# EAGLE schematic PIC_PERIPHERALS (EAGLE 6.1)

## Sheet 1 of 6: The LED Drivers for the ROV. - 2x forward facing - 2x backwards facing
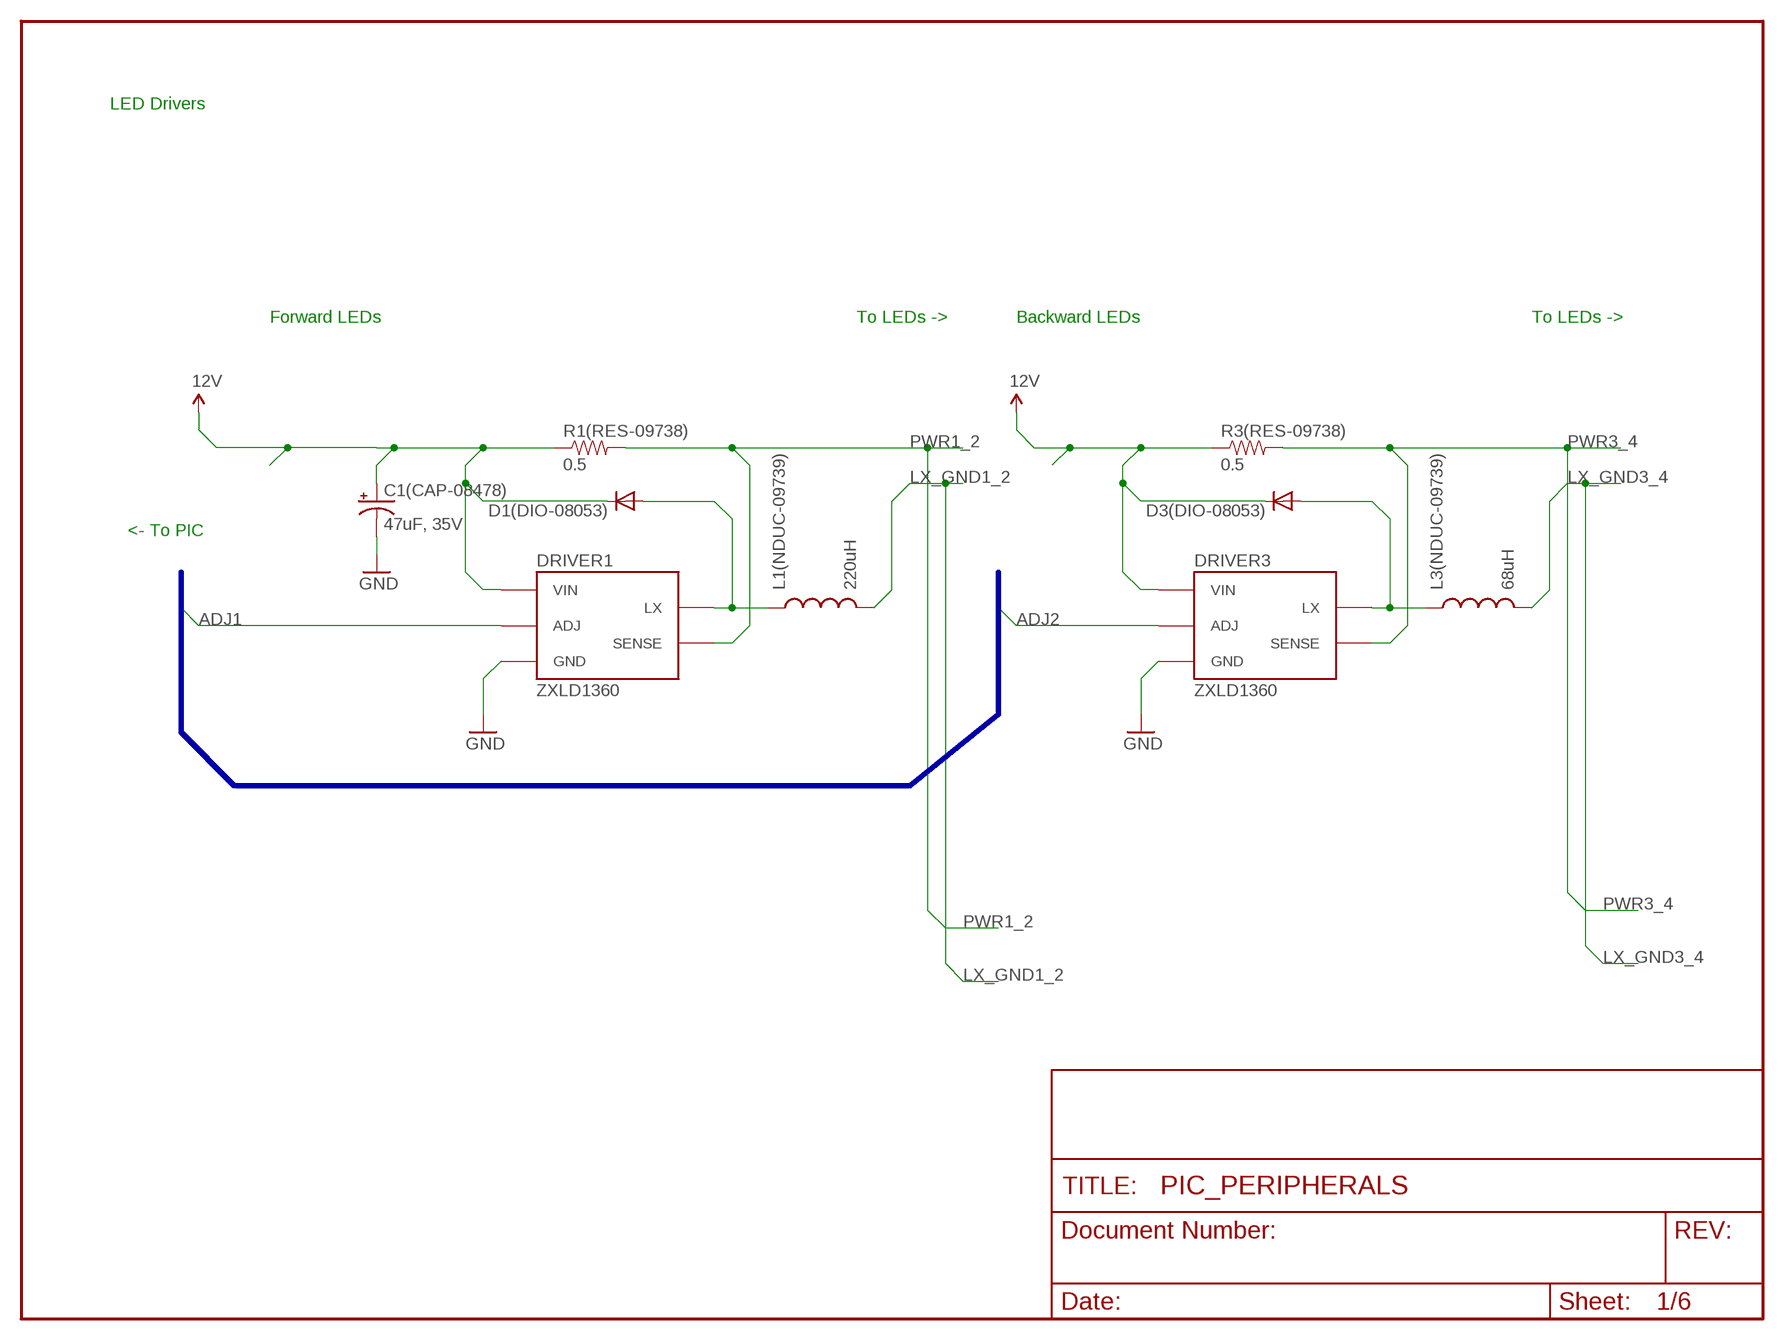
[diagram p0: schematic, sheet 1]

### Parts
C1(CAP-08478)  47uF, 35V  CAP_POL1206  [EIA3216]
D1(DIO-08053)  DIODESMA  [SMA-DIODE]
D3(DIO-08053)  DIODESMA  [SMA-DIODE]
DRIVER1  ZXLD1360  [SOT23-5]
DRIVER3  ZXLD1360  [SOT23-5]
L1(NDUC-09739)  220uH  INDUCTOR-  [CDRH3D28]
L3(NDUC-09739)  68uH  INDUCTOR-  [CDRH3D28]
R1(RES-09738)  0.5  RESISTOR0805-RES  [0805]
R3(RES-09738)  0.5  RESISTOR0805-RES  [0805]

### Nets
5V: D3(DIO-08053).C DRIVER3.5(VIN) R3(RES-09738).1 ; supply symbol labelled 12V ; also sheet 2,3,4,5,6
12V: C1(CAP-08478).A(+) D1(DIO-08053).C DRIVER1.5(VIN) R1(RES-09738).1
ADJ1: DRIVER1.3(ADJ) ; also sheet 5
ADJ2: DRIVER3.3(ADJ) ; also sheet 5
GND: C1(CAP-08478).C(-) DRIVER1.2(GND) DRIVER3.2(GND) ; also sheet 2,3,4,5,6
LX_GND1_2: L1(NDUC-09739).2
LX_GND3_4: L3(NDUC-09739).2
N$9: D1(DIO-08053).A DRIVER1.1(LX) L1(NDUC-09739).1
N$10: D3(DIO-08053).A DRIVER3.1(LX) L3(NDUC-09739).1
PWR1_2: DRIVER1.4(SENSE) R1(RES-09738).2
PWR3_4: DRIVER3.4(SENSE) R3(RES-09738).2

### Buses
B$1

### Notes on the sheet
- LED Drivers
- Forward LEDs | To LEDs -> | Backward LEDs | To LEDs ->
- <- To PIC

## Sheet 2 of 6: Ther Servo Drivers for the ROV. - Rudder Servo - Webcam Servo #1 - Webcam Servo #2
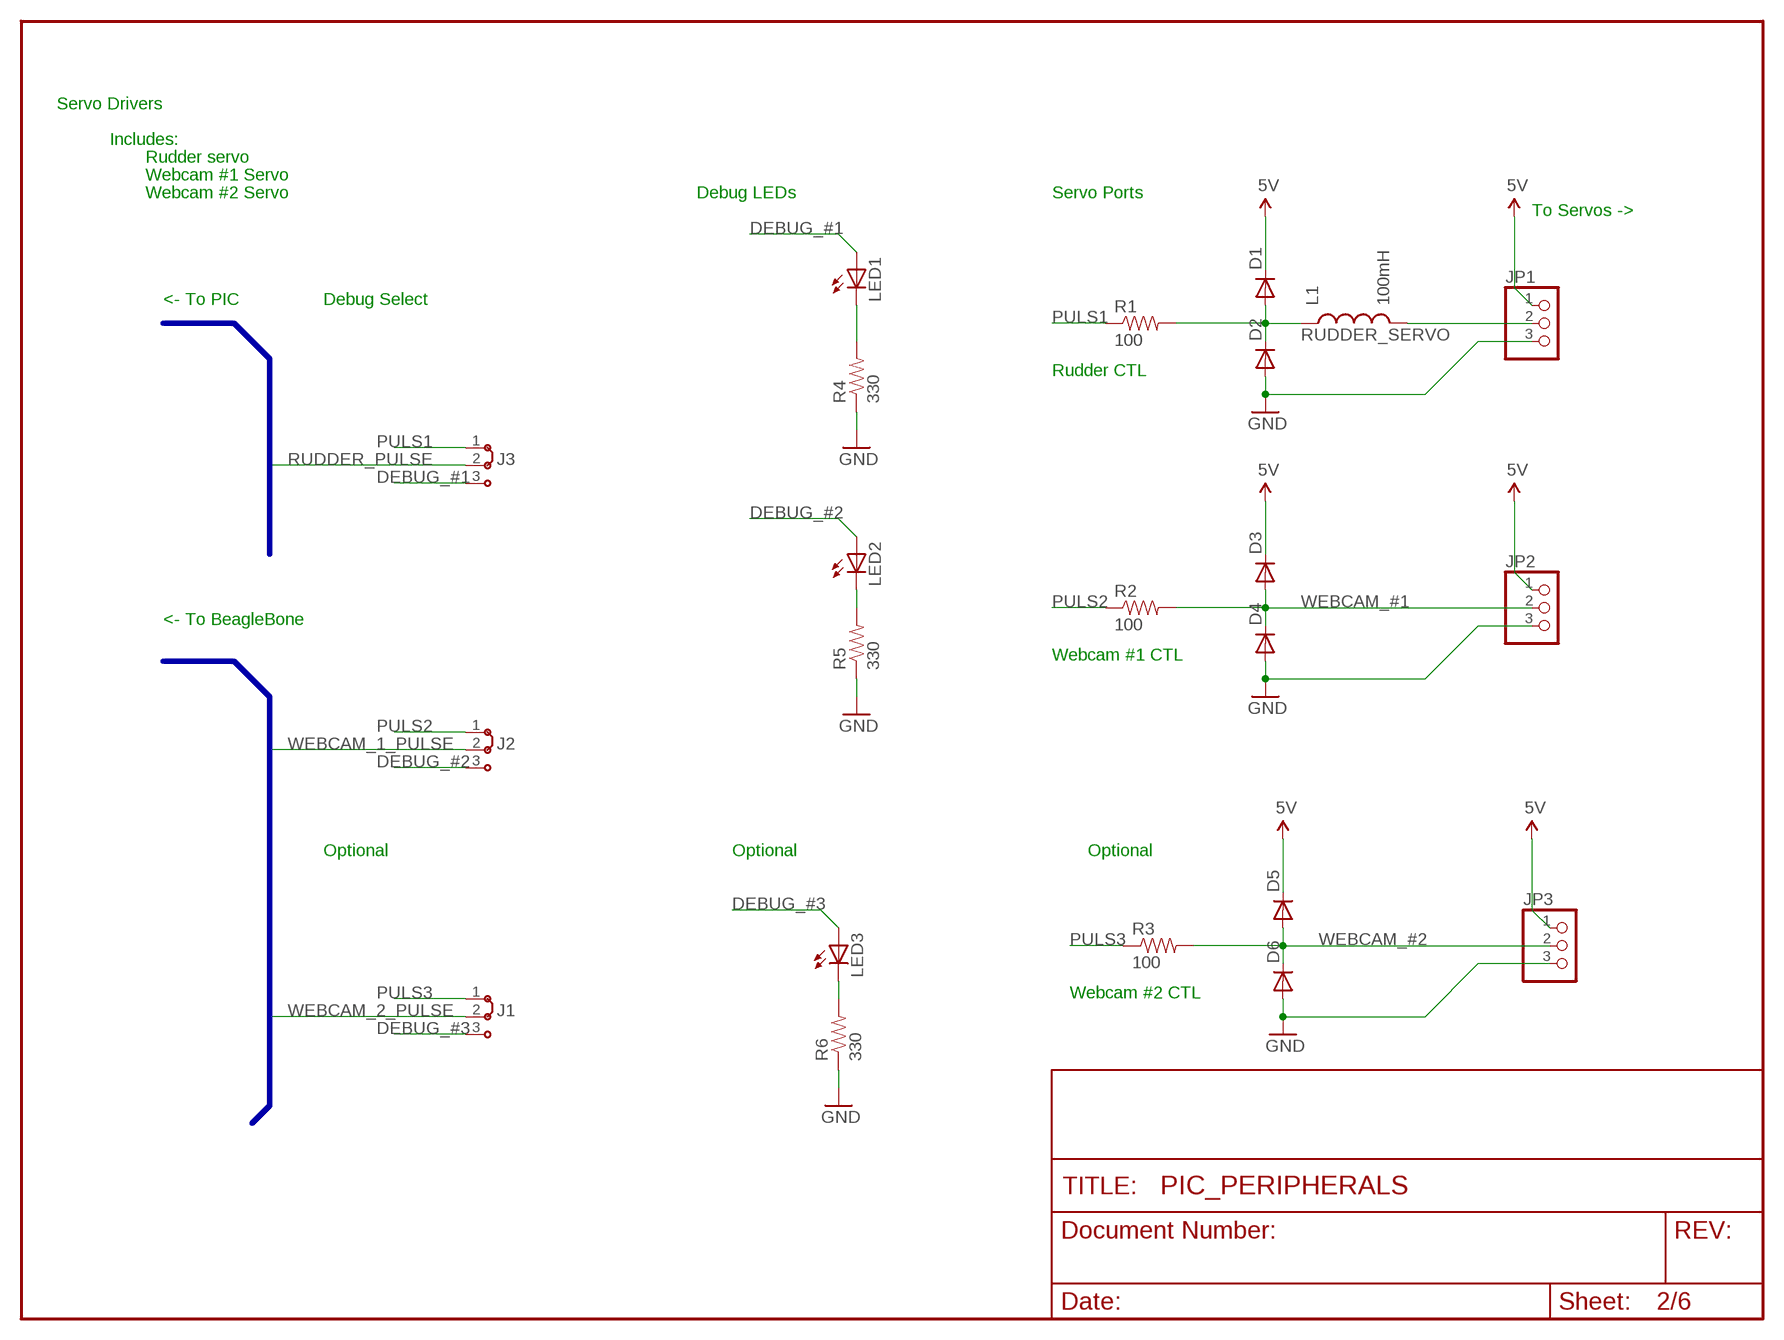
[diagram p1: schematic, sheet 2]

### Parts
D1  DIODESMA-ALT  [SMA-DIODE_ALT]
D2  DIODESMA-ALT  [SMA-DIODE_ALT]
D3  DIODESMA-ALT  [SMA-DIODE_ALT]
D4  DIODESMA-ALT  [SMA-DIODE_ALT]
D5  DIODESMA-ALT  [SMA-DIODE_ALT]
D6  DIODESMA-ALT  [SMA-DIODE_ALT]
J1  J2X2MM  [04C]
J2  J2X2MM  [04C]
J3  J2X2MM  [04C]
JP1  PINHD-1X3CB  [1X03-CLEANBIG]
JP2  PINHD-1X3CB  [1X03-CLEANBIG]
JP3  PINHD-1X3CB  [1X03-CLEANBIG]
L1  100mH  INDUCTOR0805  [0805]
LED1  LED  [SMARTLED-TTW]
LED2  LED  [SMARTLED-TTW]
LED3  LED  [SMARTLED-TTW]
R1  100  RESISTOR0402-RES  [0402-RES]
R2  100  RESISTOR0402-RES  [0402-RES]
R3  100  RESISTOR0402-RES  [0402-RES]
R4  330  RESISTOR0402-RES  [0402-RES]
R5  330  RESISTOR0402-RES  [0402-RES]
R6  330  RESISTOR0402-RES  [0402-RES]

### Nets
5V: D1.C D3.C D5.C JP1.1 JP2.1 JP3.1 ; also sheet 1,3,4,5,6
DEBUG_#1: J3.3 LED1.A@1(A)
DEBUG_#2: J2.3 LED2.A@1(A)
DEBUG_#3: J1.3 LED3.A@1(A)
GND: D2.A D4.A D6.A JP1.3 JP2.3 JP3.3 R4.1 R5.1 R6.1 ; also sheet 1,3,4,5,6
N$1: LED1.C@1(C) R4.2
N$2: LED2.C@1(C) R5.2
N$3: LED3.C@1(C) R6.2
PULS1: J3.1 R1.1
PULS2: J2.1 R2.1
PULS3: J1.1 R3.1
RUDDER_PULSE: J3.2 ; also sheet 5
RUDDER_SERVO: JP1.2 L1.2
RUDDER_SERVO1: D1.A D2.C L1.1 R1.2
WEBCAM_1_PULSE: J2.2 ; also sheet 4
WEBCAM_2_PULSE: J1.2 ; also sheet 4
WEBCAM_#1: D3.A D4.C JP2.2 R2.2
WEBCAM_#2: D5.A D6.C JP3.2 R3.2

### Buses
B$2
B$4

### Notes on the sheet
- Servo Drivers
- Includes:
- Rudder servo
- Webcam #1 Servo
- Webcam #2 Servo | Debug LEDs | Servo Ports
- To Servos ->
- <- To PIC | Debug Select
- Rudder CTL
- <- To BeagleBone
- Webcam #1 CTL
- Optional | Optional | Optional
- Webcam #2 CTL

## Sheet 3 of 6: The ESD controller drivers for the Brushless motors. - Left Thruster - Right Thruster - Vertical Thruster
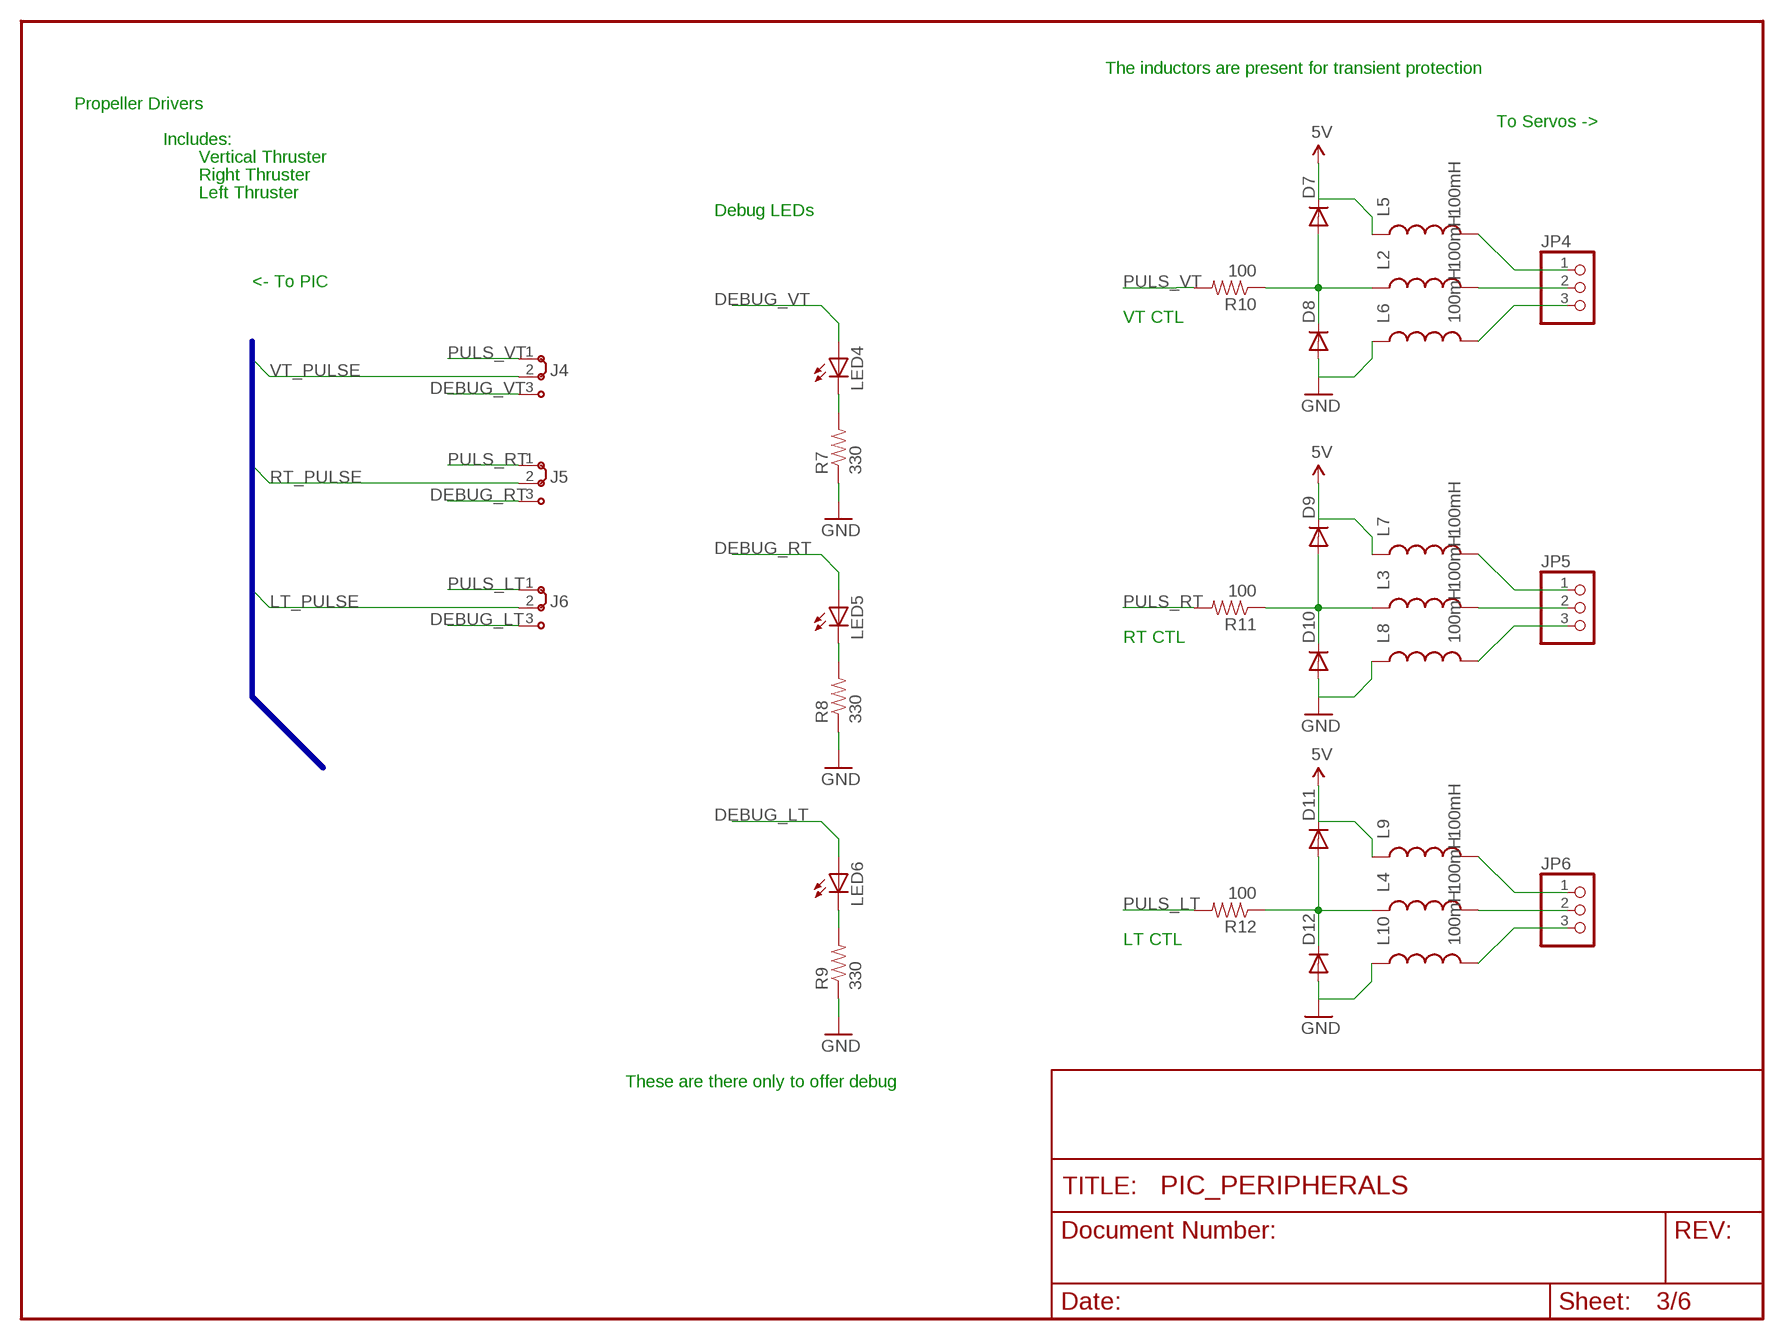
[diagram p2: schematic, sheet 3]

### Parts
D7  DIODESMA  [SMA-DIODE]
D8  DIODESMA  [SMA-DIODE]
D9  DIODESMA  [SMA-DIODE]
D10  DIODESMA  [SMA-DIODE]
D11  DIODESMA  [SMA-DIODE]
D12  DIODESMA  [SMA-DIODE]
J4  J2X2MM  [04C]
J5  J2X2MM  [04C]
J6  J2X2MM  [04C]
JP4  PINHD-1X3CB  [1X03-CLEANBIG]
JP5  PINHD-1X3CB  [1X03-CLEANBIG]
JP6  PINHD-1X3CB  [1X03-CLEANBIG]
L2  100mH  INDUCTOR0603  [0603]
L3  100mH  INDUCTOR0603  [0603]
L4  100mH  INDUCTOR0603  [0603]
L5  100mH  INDUCTOR0603  [0603]
L6  100mH  INDUCTOR0603  [0603]
L7  100mH  INDUCTOR0603  [0603]
L8  100mH  INDUCTOR0603  [0603]
L9  100mH  INDUCTOR0603  [0603]
L10  100mH  INDUCTOR0603  [0603]
LED4  LED  [SMARTLED-TTW]
LED5  LED  [SMARTLED-TTW]
LED6  LED  [SMARTLED-TTW]
R7  330  RESISTOR0402-RES  [0402-RES]
R8  330  RESISTOR0402-RES  [0402-RES]
R9  330  RESISTOR0402-RES  [0402-RES]
R10  100  RESISTOR0402-RES  [0402-RES]
R11  100  RESISTOR0402-RES  [0402-RES]
R12  100  RESISTOR0402-RES  [0402-RES]

### Nets
5V: D7.C D9.C D11.C L5.1 L7.1 L9.1 ; also sheet 1,2,4,5,6
DEBUG_LT: J6.3 LED6.A@1(A)
DEBUG_RT: J5.3 LED5.A@1(A)
DEBUG_VT: J4.3 LED4.A@1(A)
GND: D8.A D10.A D12.A L6.1 L8.1 L10.1 R7.1 R8.1 R9.1 ; also sheet 1,2,4,5,6
LT_PULSE: J6.2 ; also sheet 5
N$5: LED4.C@1(C) R7.2
N$7: LED5.C@1(C) R8.2
N$13: LED6.C@1(C) R9.2
N$15: D11.A D12.C L4.1 R12.1
N$17: D9.A D10.C L3.1 R11.1
N$18: D7.A D8.C L2.1 R10.1
N$20: JP4.1 L5.2
N$21: JP4.2 L2.2
N$22: JP4.3 L6.2
N$23: JP5.1 L7.2
N$24: JP5.2 L3.2
N$25: JP5.3 L8.2
N$26: JP6.1 L9.2
N$27: JP6.2 L4.2
N$28: JP6.3 L10.2
PULS_LT: J6.1 R12.2
PULS_RT: J5.1 R11.2
PULS_VT: J4.1 R10.2
RT_PULSE: J5.2 ; also sheet 5
VT_PULSE: J4.2 ; also sheet 5

### Buses
B$3

### Notes on the sheet
- The inductors are present for transient protection
- Propeller Drivers
- To Servos ->
- Includes:
- Vertical Thruster
- Right Thruster
- Left Thruster
- Debug LEDs
- <- To PIC
- VT CTL
- RT CTL
- LT CTL
- These are there only to offer debug

## Sheet 4 of 6: The IDEEPROM circuit and the Level Shifter circuit.
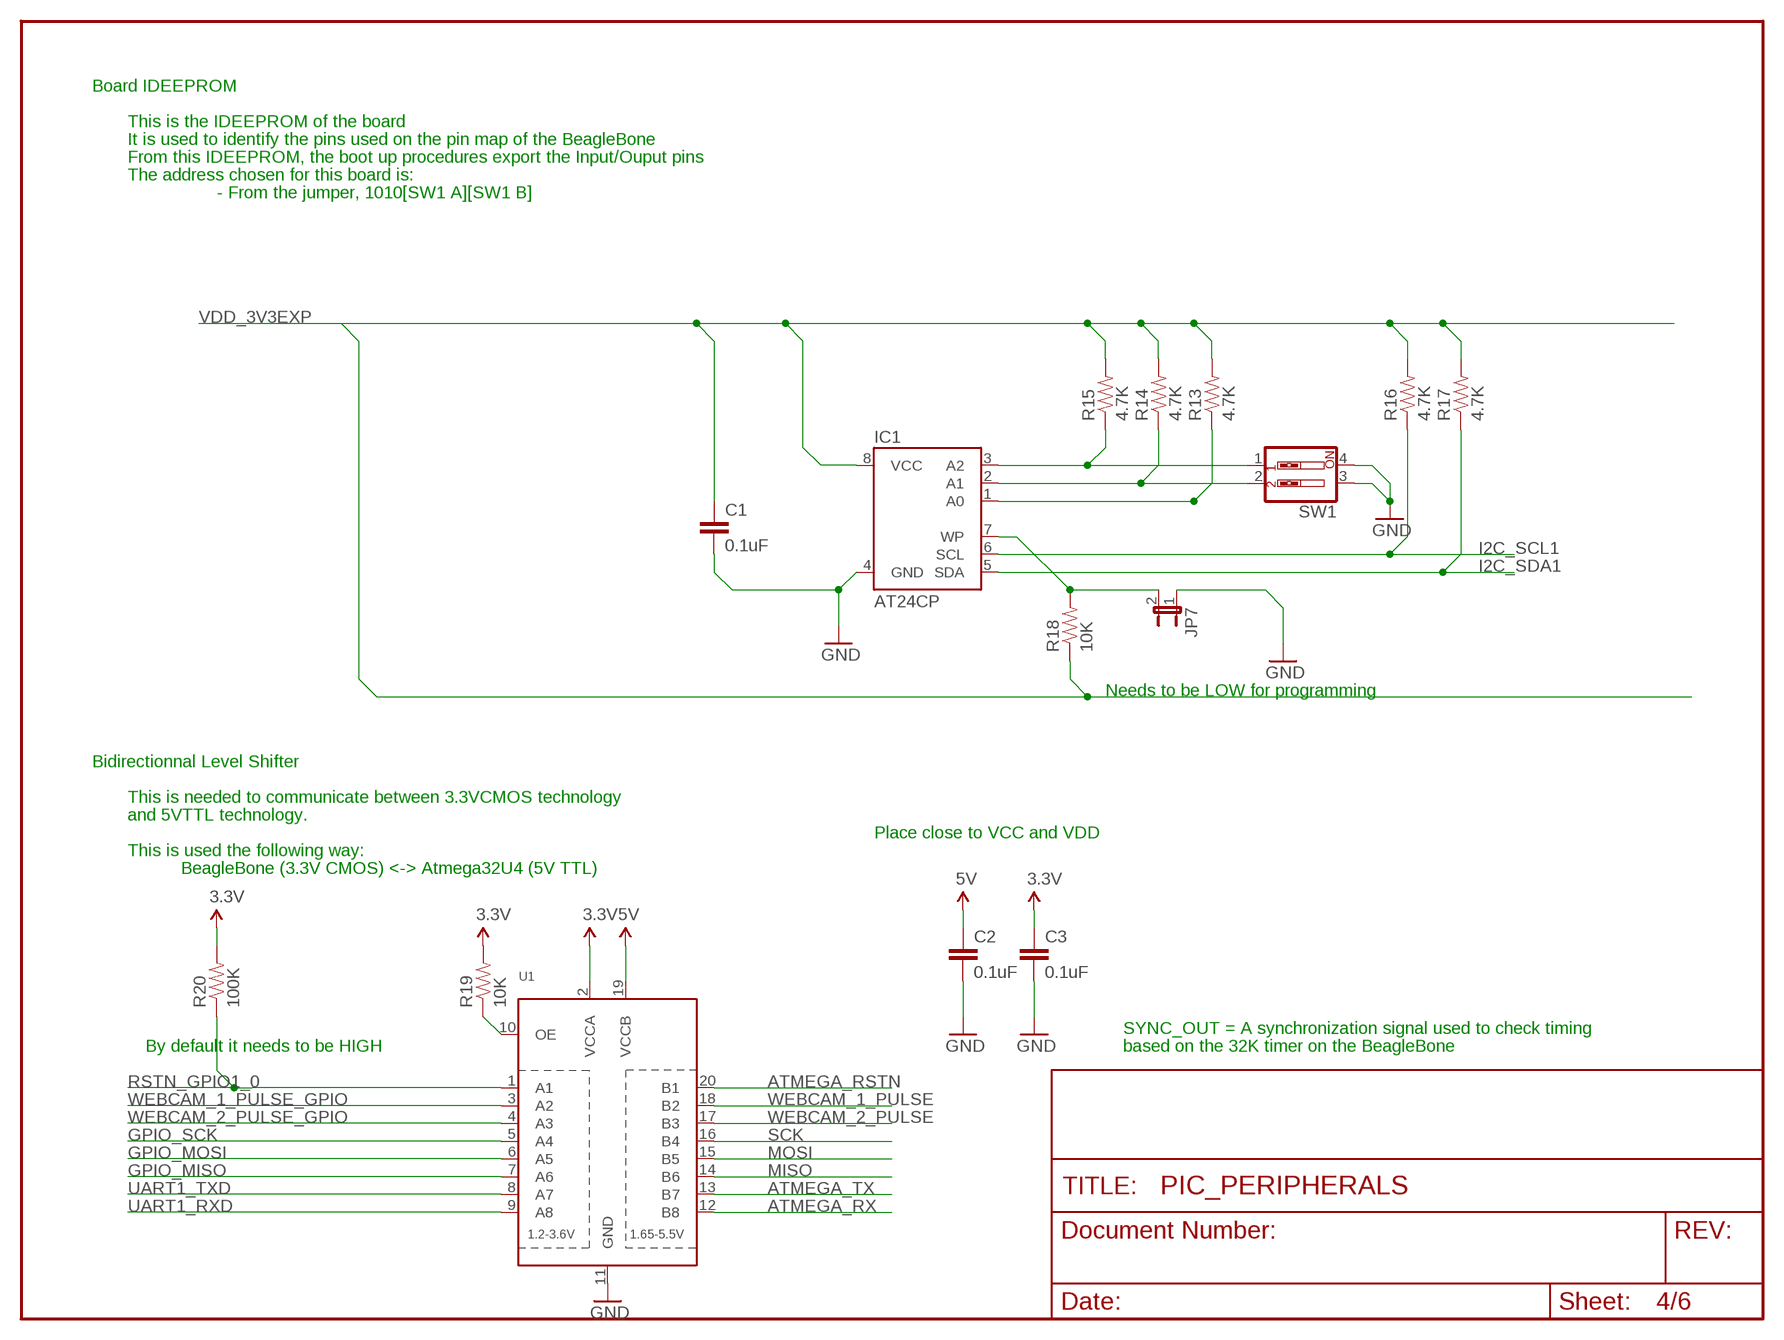
[diagram p3: schematic, sheet 4]

### Parts
C1  0.1uF  CAP0402-CAP  [0402-CAP]
C2  0.1uF  CAP0402-CAP  [0402-CAP]
C3  0.1uF  CAP0402-CAP  [0402-CAP]
IC1  AT24CP  [DIL08]
JP7  JUMPER-2PTH  [1X02]
R13  4.7K  RESISTOR0402-RES  [0402-RES]
R14  4.7K  RESISTOR0402-RES  [0402-RES]
R15  4.7K  RESISTOR0402-RES  [0402-RES]
R16  4.7K  RESISTOR0402-RES  [0402-RES]
R17  4.7K  RESISTOR0402-RES  [0402-RES]
R18  10K  RESISTOR0402-RES  [0402-RES]
R19  10K  RESISTOR0402-RES  [0402-RES]
R20  100K  RESISTOR0402-RES  [0402-RES]
SW1  SW_DIP-2  [DIPSWITCH-02]
U1  TXB0108PWR  [TSSOP20]

### Nets
3.3V: C3.1 R19.2 R20.2 U1.2(VCCA) ; also sheet 6
5V: C2.1 U1.19(VCCB) ; also sheet 1,2,3,5,6
ATMEGA_RSTN: U1.20(B1) ; also sheet 5
ATMEGA_RX: U1.12(B8) ; also sheet 5
ATMEGA_TX: U1.13(B7) ; also sheet 5
GND: C1.2 C2.2 C3.2 IC1.4(GND) JP7.1 SW1.3 SW1.4 U1.11(GND) ; also sheet 1,2,3,5,6
GPIO_MISO: U1.7(A6) ; also sheet 6
GPIO_MOSI: U1.6(A5) ; also sheet 6
GPIO_SCK: U1.5(A4) ; also sheet 6
I2C_SCL1: IC1.6(SCL) R16.1 ; also sheet 6
I2C_SDA1: IC1.5(SDA) R17.1 ; also sheet 6
MISO: U1.14(B6) ; also sheet 5
MOSI: U1.15(B5) ; also sheet 5
N$4: IC1.3(A2) R15.1 SW1.1
N$6: IC1.2(A1) R14.1 SW1.2
N$12: IC1.1(A0) R13.1
N$14: IC1.7(WP) JP7.2 R18.2
N$16: R19.1 U1.10(OE)
RSTN_GPIO1_0: R20.1 U1.1(A1) ; also sheet 6
SCK: U1.16(B4) ; also sheet 5
UART1_RXD: U1.9(A8) ; also sheet 6
UART1_TXD: U1.8(A7) ; also sheet 6
VDD_3V3EXP: C1.1 IC1.8(VCC) R13.2 R14.2 R15.2 R16.2 R17.2 R18.1
WEBCAM_1_PULSE: U1.18(B2) ; also sheet 2
WEBCAM_1_PULSE_GPIO: U1.3(A2) ; also sheet 6
WEBCAM_2_PULSE: U1.17(B3) ; also sheet 2
WEBCAM_2_PULSE_GPIO: U1.4(A3) ; also sheet 6

### Notes on the sheet
- Board IDEEPROM
- This is the IDEEPROM of the board
- It is used to identify the pins used on the pin map of the BeagleBone
- From this IDEEPROM, the boot up procedures export the Input/Ouput pins
- The address chosen for this board is:
- - From the jumper, 1010[SW1 A][SW1 B]
- Needs to be LOW for programming
- Bidirectionnal Level Shifter
- This is needed to communicate between 3.3VCMOS technology
- and 5VTTL technology.
- Place close to VCC and VDD
- This is used the following way:
- BeagleBone (3.3V CMOS) <-> Atmega32U4 (5V TTL)
- SYNC_OUT = A synchronization signal used to check timing
- By default it needs to be HIGH | based on the 32K timer on the BeagleBone

## Sheet 5 of 6: Atmega34U4 peripheral controller.
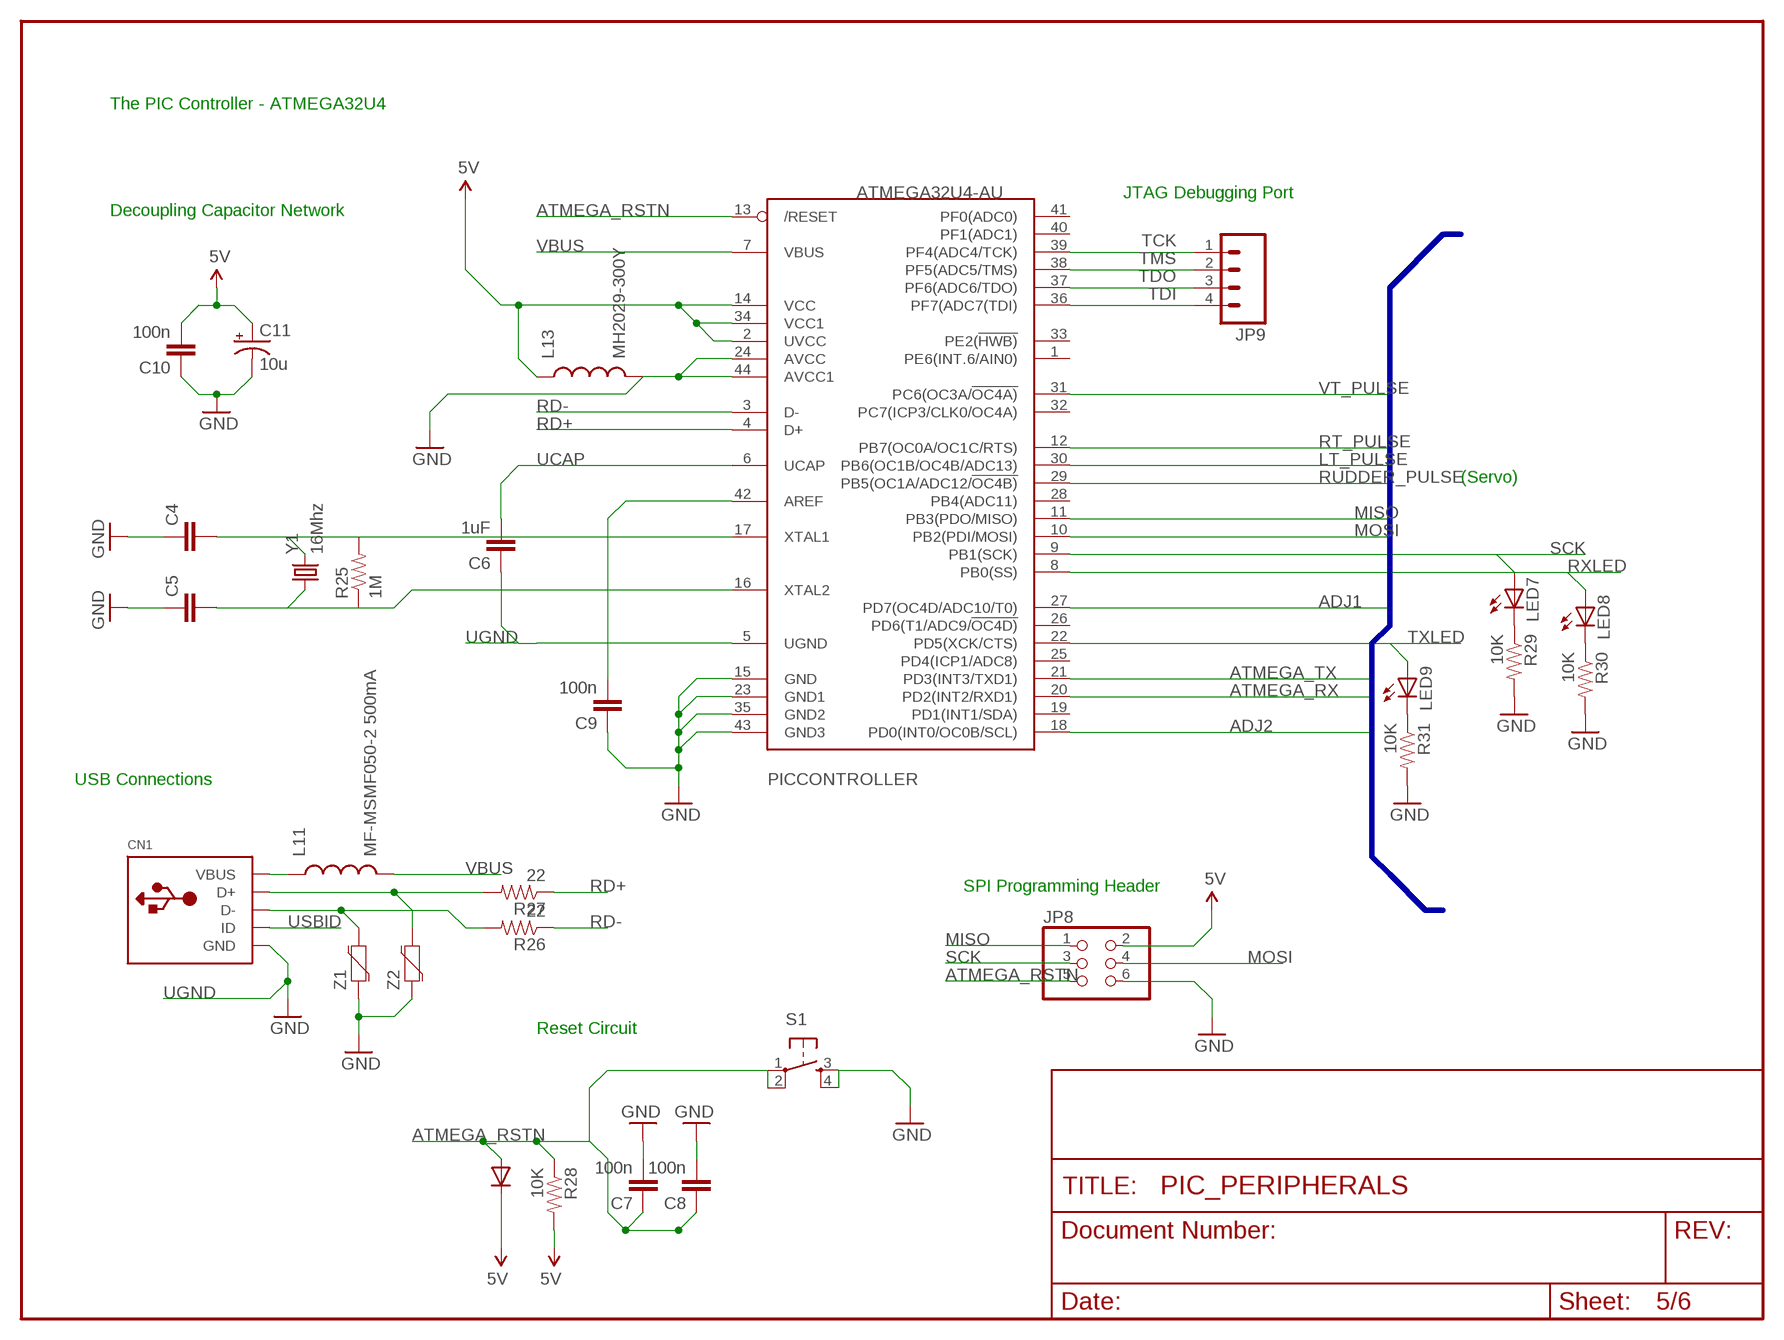
[diagram p4: schematic, sheet 5]

### Parts
C4  CAP0402-CAP  [0402-CAP]
C5  CAP0402-CAP  [0402-CAP]
C6  1uF  CAP0402-CAP  [0402-CAP]
C7  100n  CAP0402-CAP  [0402-CAP]
C8  100n  CAP0402-CAP  [0402-CAP]
C9  100n  CAP0402-CAP  [0402-CAP]
C10  100n  CAP0402-CAP  [0402-CAP]
C11  10u  CAP_POL1206  [EIA3216]
CN1  USBMINIB  [USB-MINIB]
JP8  PINHD-2X3  [2X03]
JP9  M04SMD  [1X04-SMD]
L11  MF-MSMF050-2 500mA  INDUCTOR-  [CDRH3D28]
L13  MH2029-300Y  INDUCTOR-  [CDRH3D28]
LED7  LED  [SMARTLED-TTW]
LED8  LED  [SMARTLED-TTW]
LED9  LED  [SMARTLED-TTW]
PICCONTROLLER  ATMEGA32U4-AU  [TQFP44]
R25  1M  RESISTOR0402-RES  [0402-RES]
R26  22  RESISTOR0402-RES  [0402-RES]
R27  22  RESISTOR0402-RES  [0402-RES]
R28  10K  RESISTOR0402-RES  [0402-RES]
R29  10K  RESISTOR0402-RES  [0402-RES]
R30  10K  RESISTOR0402-RES  [0402-RES]
R31  10K  RESISTOR0402-RES  [0402-RES]
S1  TAC_SWITCHPTH  [TACTILE-PTH]
Y1  16Mhz  CRYSTAL5X3  [CRYSTAL-SMD-5X3]
Z1  VARISTOR-0402  [0402-RES]
Z2  VARISTOR-0402  [0402-RES]

### Nets
5V: C10.2 C11.A(+) JP8.2 L13.1 PICCONTROLLER.2(UVCC) PICCONTROLLER.14(VCC) PICCONTROLLER.34(VCC1) R28.2 ; also sheet 1,2,3,4,6
ADJ1: PICCONTROLLER.27(PD7(OC4D/ADC10/T0)) ; also sheet 1
ADJ2: PICCONTROLLER.18(PD0(INT0/OC0B/SCL)) ; also sheet 1
ATMEGA_RSTN: C7.1 C8.1 JP8.5 PICCONTROLLER.13(/RESET) R28.1 S1.1 S1.2 ; also sheet 4
ATMEGA_RX: PICCONTROLLER.20(PD2(INT2/RXD1)) ; also sheet 4
ATMEGA_TX: PICCONTROLLER.21(PD3(INT3/TXD1)) ; also sheet 4
GND: C4.1 C5.1 C7.2 C8.2 C9.1 C10.1 C11.C(-) JP8.6 L13.2 PICCONTROLLER.15(GND) PICCONTROLLER.23(GND1) PICCONTROLLER.24(AVCC) PICCONTROLLER.35(GND2) PICCONTROLLER.43(GND3) PICCONTROLLER.44(AVCC1) R29.2 R30.2 R31.2 S1.3 S1.4 Z1.1 Z2.1 ; also sheet 1,2,3,4,6
LT_PULSE: PICCONTROLLER.30(PB6(OC1B/OC4B/ADC13)) ; also sheet 3
MISO: JP8.1 PICCONTROLLER.11(PB3(PDO/MISO)) ; also sheet 4
MOSI: JP8.4 PICCONTROLLER.10(PB2(PDI/MOSI)) ; also sheet 4
N$19: C4.2 PICCONTROLLER.17(XTAL1) R25.2 Y1.3
N$29: C5.2 PICCONTROLLER.16(XTAL2) R25.1 Y1.1
N$30: CN1.D- R26.2 Z1.2
N$31: CN1.D+ R27.2 Z2.2
N$32: CN1.VBUS L11.1
N$33: C9.2 PICCONTROLLER.42(AREF)
N$34: LED7.C@1(C) R29.1
N$35: LED9.C@1(C) R31.1
N$36: LED8.C@1(C) R30.1
RD+: PICCONTROLLER.4(D+) R27.1
RD-: PICCONTROLLER.3(D-) R26.1
RT_PULSE: PICCONTROLLER.12(PB7(OC0A/OC1C/RTS)) ; also sheet 3
RUDDER_PULSE: PICCONTROLLER.29(PB5(OC1A/ADC12/!OC4B)) ; also sheet 2
RXLED: PICCONTROLLER.8(PB0(SS))
SCK: JP8.3 LED7.A@1(A) PICCONTROLLER.9(PB1(SCK)) ; also sheet 4
TCK: JP9.1 PICCONTROLLER.39(PF4(ADC4/TCK))
TDI: JP9.4 PICCONTROLLER.36(PF7(ADC7(TDI))
TDO: JP9.3 PICCONTROLLER.37(PF6(ADC6/TDO))
TMS: JP9.2 PICCONTROLLER.38(PF5(ADC5/TMS))
TXLED: PICCONTROLLER.22(PD5(XCK/CTS))
UCAP: C6.2 PICCONTROLLER.6(UCAP)
UGND: C6.1 CN1.GND PICCONTROLLER.5(UGND) ; supply symbol labelled GND
USBID: CN1.ID
VBUS: L11.2 PICCONTROLLER.7(VBUS)
VT_PULSE: PICCONTROLLER.31(PC6(OC3A/!OC4A)) ; also sheet 3
Unconnected: LED8.A@1(A) LED9.A@1(A) PICCONTROLLER.1(PE6(INT.6/AIN0)) PICCONTROLLER.19(PD1(INT1/SDA)) PICCONTROLLER.25(PD4(ICP1/ADC8)) PICCONTROLLER.26(PD6(T1/ADC9/!OC4D)) PICCONTROLLER.28(PB4(ADC11)) PICCONTROLLER.32(PC7(ICP3/CLK0/OC4A)) PICCONTROLLER.33(PE2(!HWB)) PICCONTROLLER.40(PF1(ADC1)) PICCONTROLLER.41(PF0(ADC0))

### Buses
B$5

### Notes on the sheet
- The PIC Controller - ATMEGA32U4
- JTAG Debugging Port
- Decoupling Capacitor Network
- (Servo)
- USB Connections
- SPI Programming Header
- Reset Circuit

## Sheet 6 of 6: BeagleBone Pin maps.
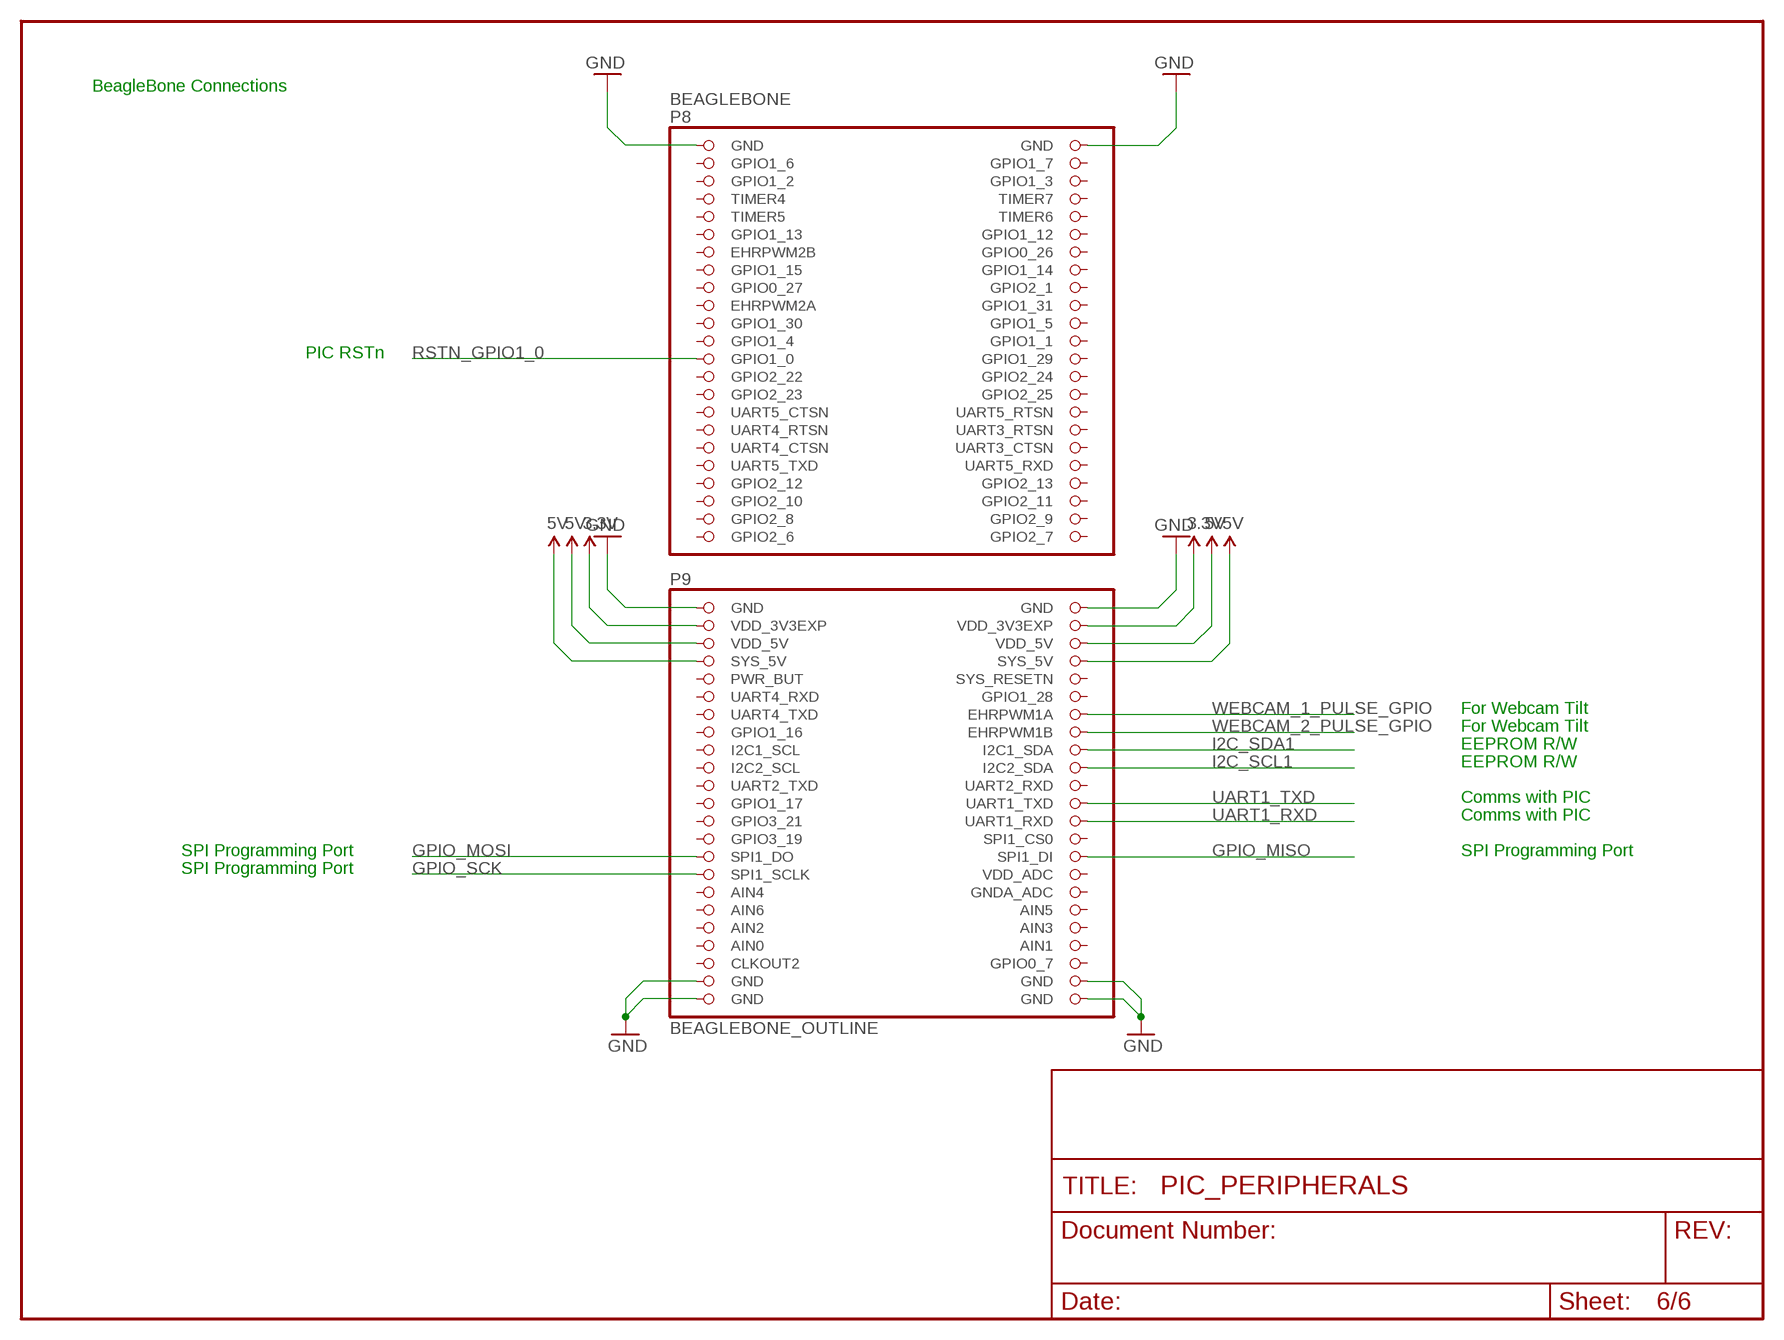
[diagram p5: schematic, sheet 6]

### Parts
BEAGLEBONE  BEAGLEBONE_OUTLINE  [BEAGLEBONE_SHIELD]

### Nets
3.3V: BEAGLEBONE.49(VDD_3V3EXP) BEAGLEBONE.50(VDD_3V3EXP) ; also sheet 4
5V: BEAGLEBONE.51(VDD_5V) BEAGLEBONE.52(VDD_5V) BEAGLEBONE.53(SYS_5V) BEAGLEBONE.54(SYS_5V) ; also sheet 1,2,3,4,5
GND: BEAGLEBONE.1(GND) BEAGLEBONE.2(GND) BEAGLEBONE.47(GND) BEAGLEBONE.48(GND) BEAGLEBONE.89(GND) BEAGLEBONE.90(GND) BEAGLEBONE.91(GND) BEAGLEBONE.92(GND) ; also sheet 1,2,3,4,5
GPIO_MISO: BEAGLEBONE.76(SPI1_DI) ; also sheet 4
GPIO_MOSI: BEAGLEBONE.75(SPI1_DO) ; also sheet 4
GPIO_SCK: BEAGLEBONE.77(SPI1_SCLK) ; also sheet 4
I2C_SCL1: BEAGLEBONE.66(I2C2_SDA) ; also sheet 4
I2C_SDA1: BEAGLEBONE.64(I2C1_SDA) ; also sheet 4
RSTN_GPIO1_0: BEAGLEBONE.25(GPIO1_0) ; also sheet 4
UART1_RXD: BEAGLEBONE.72(UART1_RXD) ; also sheet 4
UART1_TXD: BEAGLEBONE.70(UART1_TXD) ; also sheet 4
WEBCAM_1_PULSE_GPIO: BEAGLEBONE.60(EHRPWM1A) ; also sheet 4
WEBCAM_2_PULSE_GPIO: BEAGLEBONE.62(EHRPWM1B) ; also sheet 4
Unconnected: BEAGLEBONE.3(GPIO1_6) BEAGLEBONE.4(GPIO1_7) BEAGLEBONE.5(GPIO1_2) BEAGLEBONE.6(GPIO1_3) BEAGLEBONE.7(TIMER4) BEAGLEBONE.8(TIMER7) BEAGLEBONE.9(TIMER5) BEAGLEBONE.10(TIMER6) BEAGLEBONE.11(GPIO1_13) BEAGLEBONE.12(GPIO1_12) BEAGLEBONE.13(EHRPWM2B) BEAGLEBONE.14(GPIO0_26) BEAGLEBONE.15(GPIO1_15) BEAGLEBONE.16(GPIO1_14) BEAGLEBONE.17(GPIO0_27) BEAGLEBONE.18(GPIO2_1) BEAGLEBONE.19(EHRPWM2A) BEAGLEBONE.20(GPIO1_31) BEAGLEBONE.21(GPIO1_30) BEAGLEBONE.22(GPIO1_5) BEAGLEBONE.23(GPIO1_4) BEAGLEBONE.24(GPIO1_1) BEAGLEBONE.26(GPIO1_29) BEAGLEBONE.27(GPIO2_22) BEAGLEBONE.28(GPIO2_24) BEAGLEBONE.29(GPIO2_23) BEAGLEBONE.30(GPIO2_25) BEAGLEBONE.31(UART5_CTSN) BEAGLEBONE.32(UART5_RTSN) BEAGLEBONE.33(UART4_RTSN) BEAGLEBONE.34(UART3_RTSN) BEAGLEBONE.35(UART4_CTSN) BEAGLEBONE.36(UART3_CTSN) BEAGLEBONE.37(UART5_TXD) BEAGLEBONE.38(UART5_RXD) BEAGLEBONE.39(GPIO2_12) BEAGLEBONE.40(GPIO2_13) BEAGLEBONE.41(GPIO2_10) BEAGLEBONE.42(GPIO2_11) BEAGLEBONE.43(GPIO2_8) BEAGLEBONE.44(GPIO2_9) BEAGLEBONE.45(GPIO2_6) BEAGLEBONE.46(GPIO2_7) BEAGLEBONE.55(PWR_BUT) BEAGLEBONE.56(SYS_RESETN) BEAGLEBONE.57(UART4_RXD) BEAGLEBONE.58(GPIO1_28) BEAGLEBONE.59(UART4_TXD) BEAGLEBONE.61(GPIO1_16) BEAGLEBONE.63(I2C1_SCL) BEAGLEBONE.65(I2C2_SCL) BEAGLEBONE.67(UART2_TXD) BEAGLEBONE.68(UART2_RXD) BEAGLEBONE.69(GPIO1_17) BEAGLEBONE.71(GPIO3_21) BEAGLEBONE.73(GPIO3_19) BEAGLEBONE.74(SPI1_CS0) BEAGLEBONE.78(VDD_ADC) BEAGLEBONE.79(AIN4) BEAGLEBONE.80(GNDA_ADC) BEAGLEBONE.81(AIN6) BEAGLEBONE.82(AIN5) BEAGLEBONE.83(AIN2) BEAGLEBONE.84(AIN3) BEAGLEBONE.86(AIN1) BEAGLEBONE.87(CLKOUT2) BEAGLEBONE.88(GPIO0_7)

### Notes on the sheet
- BeagleBone Connections
- PIC RSTn
- For Webcam Tilt
- For Webcam Tilt
- EEPROM R/W
- EEPROM R/W
- Comms with PIC
- Comms with PIC
- SPI Programming Port | SPI Programming Port
- SPI Programming Port

## Power pins joined to a net without a drawn wire
AIN0: BEAGLEBONE.85(AIN0)

## Library data of the parts
BEAGLEBONE = adafruit:BEAGLEBONE_OUTLINE: Should match A3 pinout - but not completely tested
C1-C10 = SparkFun:CAP: Capacitor Standard 0603 ceramic capacitor, and 0.1" leaded capacitor.
C1(CAP-08478) C11 = SparkFun:CAP_POL: Capacitor Polarized These are standard SMD and PTH capacitors. Normally 10uF, 47uF, and 100uF in electrolytic and tantalum varieties. Always verify the external diameter of the through hole cap, it varies with capacity, voltage, and manufacturer. The EIA devices should be standard.
CN1 = adafruit:USB: USB Connectors USBMINIB - Surface Mount Female Mini-B USB Connector 4UConnector: 06564 By microbuilder.eu Thru-hole RA Female Mini-B USB Connector 4UConnector: 18732 By ladyada.net
D1 D1(DIO-08053) D2 D3 D3(DIO-08053) D4-D12 = SparkFun:DIODE: Diode These are standard reverse protection diodes and small signal diodes. SMA package can handle up to about 1A. SOD-323 can handle about 200mA. What the SOD-323 package when ordering, there are some mfgs out there that are 5-pin packages.
DRIVER1 DRIVER3 = SparkFun:ZXLD1360: Adjustable constant current switching driver for high-power LEDs
IC1 = atmel:AT24C*: 2-wire serial EEPROM; MPN: AT24C1024BW-SH-B; OC_FARNELL: 1362646; OC_NEWARK: 03P2044
J1-J6 = jumper:J2: Jumper switch 2 x 2.5 mm
JP1-JP6 = adafruit:PINHD-1X3: PIN HEADER
JP7 = SparkFun:JUMPER-2: Jumper Basic 0.1" spaced jumper. Use with breakaway headers.
JP8 = SparkFun:PINHD-2X3: PIN HEADER
JP9 = SparkFun:M04: Header 4 Standard 4-pin 0.1" header. Use with straight break away headers (SKU : PRT-00116), right angle break away headers (PRT-00553), swiss pins (PRT-00743), machine pins (PRT-00117), and female headers (PRT-00115). Molex polarized connector foot print use with SKU : PRT-08231 with associated crimp pins and housings. 1MM SMD Version SKU: PRT-10208
L1 L1(NDUC-09739) L2 L3 L3(NDUC-09739) L4-L11 L13 = SparkFun:INDUCTOR: Inductors Basic Inductor/Choke - 0603 and 1206. Footprints are not proven and vary greatly between part numbers.
LED1-LED9 = adafruit:LED: LED OSRAM: - CHIPLED LG R971, LG N971, LY N971, LG Q971, LY Q971, LO R971, LY R971 LH N974, LH R974 LS Q976, LO Q976, LY Q976 LO Q996 - Hyper CHIPLED LW Q18S LB Q993, LB Q99A, LB R99A - SideLED LS A670, LO A670, LY A670, LG A670, LP A670 LB A673, LV A673, LT A673, LW A673 LH A674 LY A675 LS A676, LA A676, LO A676, LY A676, LW A676 LS A679, LY A679, LG A679 - Hyper Micro SIDELED® LS Y876, LA Y876, LO Y876, LY Y876 LT Y87S - SmartLED LW L88C, LW L88S LB L89C, LB L89S, LG L890 LS L89K, LO L89K, LY L89K LS L896, LA L896, LO L896, LY L896 - TOPLED LS T670, LO T670, LY T670, LG T670, LP T670 LSG T670, LSP T670, LSY T670, LOP T670, LYG T670 LG T671, LOG T671, LSG T671 LB T673, LV T673, LT T673, LW T673 LH T674 LS T676, LA T676, LO T676, LY T676, LB T676, LH T676, LSB T676, LW T676 LB T67C, LV T67C, LT T67C, LS T67K, LO T67K, LY T67K, LW E67C LS E67B, LA E67B, LO E67B, LY E67B, LB E67C, LV E67C, LT E67C LW T67C LS T679, LY T679, LG T679 LS T770, LO T770, LY T770, LG T770, LP T770 LB T773, LV T773, LT T773, LW T773 LH T774 LS E675, LA E675, LY E675, LS T675 LS T776, LA T776, LO T776, LY T776, LB T776 LHGB T686 LT T68C, LB T68C - Hyper Mini TOPLED® LB M676 - Mini TOPLED Santana® LG M470 LS M47K, LO M47K, LY M47K Source: http://www.osram.convergy.de/
PICCONTROLLER = adafruit:ATMEGA32U4: http://www.ladyada.net/library/eagle
R1 R1(RES-09738) R2 R3 R3(RES-09738) R4-R20 R25-R31 = SparkFun:RESISTOR: Resistor Basic schematic elements and footprints for 0603, 1206, and PTH resistors.
S1 = SparkFun:TAC_SWITCH: Momentary Switch Button commonly used for reset or general input. Spark Fun Electronics SKU : COM-00097
SW1 = SparkFun:SW_DIP-2: DIP SWITCH
U1 = adafruit:TXB0108PWR: 8-Bit Bi-Directional Level Shifter 1.2V-3.6V (VCCA) to 1.65V-5.5V (VCCB) bi-directional level shifter with auto direction sensing. Max data rate - VCCA 1.8V: 20Mbps (50ns), VCCA 3.3V: 100Mbps (10ns) Digikey: 296-21527-1-ND
Y1 = SparkFun:CRYSTAL: Crystals Various standard crystals. Proven footprints. Spark Fun Electronics SKU : COM-00534
Z1 Z2 = SparkFun:VARISTOR: Varistor Varistor (Variable resistor) is a nonlinear resistive element of the voltage dependence that resistance changes with applied voltage. Varistor is equivalent with Zener diode of two series connection.